# EAGLE design PlugEVSE_Main (EAGLE 8.6.0)
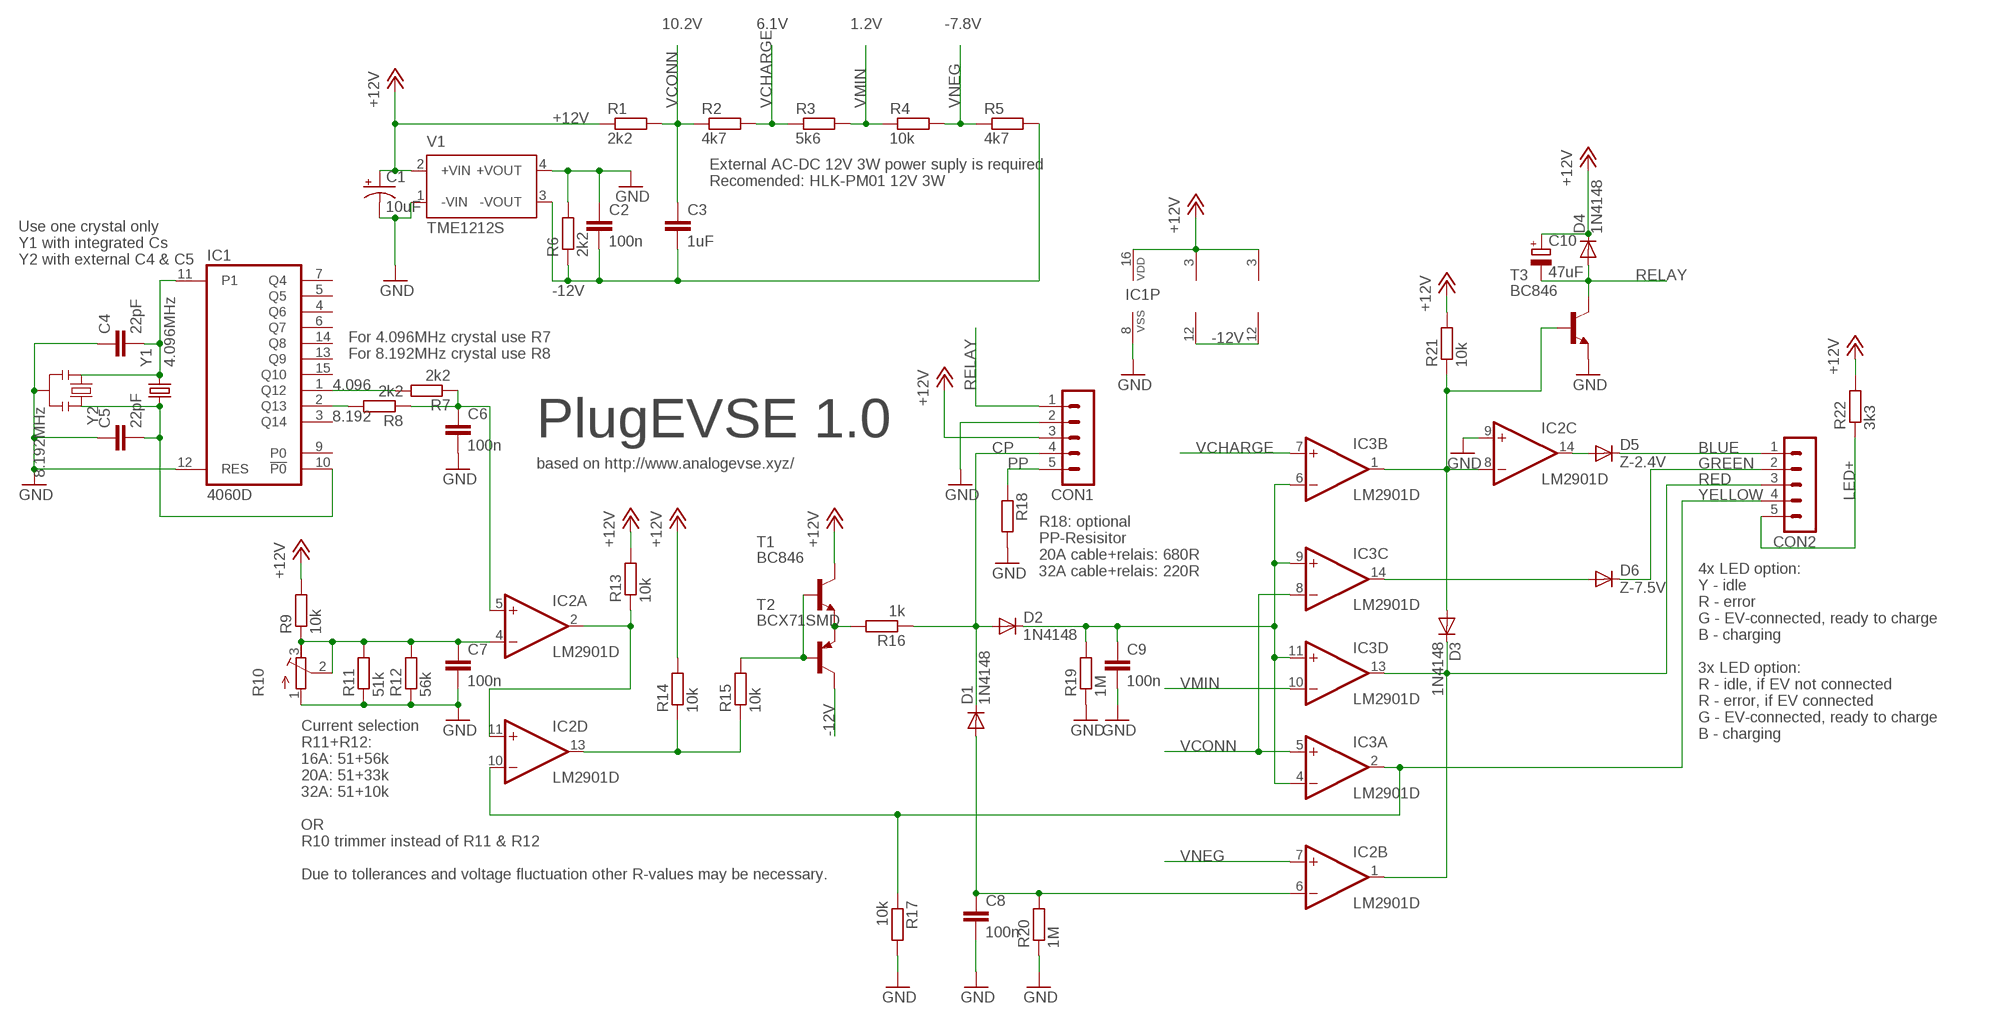
[diagram p0: schematic, sheet 1]

## Parts
C1  10uF  CAP_POL1206  [EIA3216]
C2  100n  C-EUC0603  [C0603]
C3  1uF  C-EUC0603  [C0603]
C4  22pF  C-EUC0603  [C0603]
C5  22pF  C-EUC0603  [C0603]
C6  100n  C-EUC0603  [C0603]
C7  100n  C-EUC0603  [C0603]
C8  100n  C-EUC0603  [C0603]
C9  100n  C-EUC0603  [C0603]
C10  47uF  CPOL-EUE2.5-5  [E2,5-5]
CON1  MA05-1  [MA05-1]
CON2  MA05-1  [MA05-1]
D1  1N4148  DIODE-SOD123  [SOD123]
D2  1N4148  DIODE-SOD123  [SOD123]
D3  1N4148  DIODE-SOD123  [SOD123]
D4  1N4148  DIODE-SOD123  [SOD123]
D5  Z-2.4V  DIODE-SOD123  [SOD123]
D6  Z-7.5V  DIODE-SOD123  [SOD123]
IC1  4060D  [SO16]
IC2  LM2901D  [SO14]
IC3  LM2901D  [SO14]
R1  2k2  R-EU_R0603  [R0603]
R2  4k7  R-EU_R0603  [R0603]
R3  5k6  R-EU_R0603  [R0603]
R4  10k  R-EU_R0603  [R0603]
R5  4k7  R-EU_R0603  [R0603]
R6  2k2  R-EU_R0603  [R0603]
R7  2k2  R-EU_R0603  [R0603]
R8  2k2  R-EU_R0603  [R0603]
R9  10k  R-EU_R0603  [R0603]
R10  R-TRIMM3202  [RTRIM3202]
R11  51k  R-EU_R0603  [R0603]
R12  56k  R-EU_R0603  [R0603]
R13  10k  R-EU_R0603  [R0603]
R14  10k  R-EU_R0603  [R0603]
R15  10k  R-EU_R0603  [R0603]
R16  1k  R-EU_R0603  [R0603]
R17  10k  R-EU_R0603  [R0603]
R18  R-EU_R2512  [R2512]
R19  1M  R-EU_R0603  [R0603]
R20  1M  R-EU_R0603  [R0603]
R21  10k  R-EU_R0603  [R0603]
R22  3k3  R-EU_R0603  [R0603]
T1  BC846  [SOT23]
T2  BCX71SMD  [SOT23]
T3  BC846  [SOT23]
V1  TME1212S  [TME]
Y1  4.096MHz  KX-K  [11.4X4.5]
Y2  8.192MHz  RESONATORSMD  [RESONATOR-SMD]

## Nets
+12V: C1.A(+) C10.+ CON1.3 D4.C IC1.16(VDD) IC2.3(P:V+) IC3.3(P:V+) R1.1 R9.2 R13.2 R14.2 R21.2 R22.2 T1.3(C) V1.2(+VIN)
-12V: C2.2 C3.2 IC2.12(P:V-) IC3.12(P:V-) R5.2 R6.1 T2.3(C) V1.3(-VOUT)
BLUE: CON2.1 D5.C
CP: CON1.4 D1.C D2.A R16.1
GND: C1.C(-) C2.1 C4.1 C5.1 C6.2 C7.2 C8.2 C9.2 CON1.2 IC1.8(VSS) IC1.12(RES) IC2.9(C:+IN) R6.2 R10.1(A) R11.1 R12.1 R17.2 R18.2 R19.1 R20.1 T3.2(E) V1.1(-VIN) V1.4(+VOUT) Y2.2
GREEN: CON2.2 D6.C
LED+: CON2.5 R22.1
N$1: R16.2 T1.2(E) T2.2(E)
N$2: IC1.2(Q13) R8.2
N$3: IC1.1(Q12) R7.2
N$4: C6.1 IC2.5(A:+IN) R7.1 R8.1
N$6: IC2.13(D:OUT) R14.1 R15.1
N$7: C8.1 D1.A IC2.6(B:-IN) R20.2
N$8: C9.1 D2.C IC3.4(A:-IN) IC3.6(B:-IN) IC3.9(C:+IN) IC3.11(D:+IN) R19.2
N$9: D3.A IC2.8(C:-IN) IC3.1(B:OUT) R21.1 T3.1(B)
N$11: C7.1 IC2.4(A:-IN) R9.1 R10.2(S) R10.3(E) R11.2 R12.2
N$12: IC2.2(A:OUT) IC2.11(D:+IN) R13.1
N$13: R15.2 T1.1(B) T2.1(B)
N$15: C4.2 IC1.11(P1) Y1.2 Y2.1
N$16: D5.A IC2.14(C:OUT)
N$18: D6.A IC3.14(C:OUT)
N$21: C5.2 IC1.10(!P0) Y1.1 Y2.3
PP: CON1.5 R18.1
RED: CON2.3 D3.C IC2.1(B:OUT) IC3.13(D:OUT)
RELAY: C10.- CON1.1 D4.A T3.3(C)
VCHARGE: IC3.7(B:+IN) R2.2 R3.1
VCONN: C3.1 IC3.5(A:+IN) IC3.8(C:-IN) R1.2 R2.1
VMIN: IC3.10(D:-IN) R3.2 R4.1
VNEG: IC2.7(B:+IN) R4.2 R5.1
YELLOW: CON2.4 IC2.10(D:-IN) IC3.2(A:OUT) R17.1
Unconnected: IC1.3(Q14) IC1.4(Q6) IC1.5(Q5) IC1.6(Q7) IC1.7(Q4) IC1.9(P0) IC1.13(Q9) IC1.14(Q8) IC1.15(Q10)

## Notes on the sheet
- 10.2V | 6.1V | 1.2V | -7.8V
- External AC-DC 12V 3W power suply is required
  Recomended: HLK-PM01 12V 3W
- Use one crystal only 
  Y1 with integrated Cs
  Y2 with external C4 & C5
- For 4.096MHz crystal use R7
  For 8.192MHz crystal use R8
- 4.096
- 8.192
- PlugEVSE 1.0
- based on http://www.analogevse.xyz/
- R18: optional
  PP-Resisitor
  20A cable+relais: 680R
  32A cable+relais: 220R
- 4x LED option:
  Y - idle
  R - error
  G - EV-connected, ready to charge
  B - charging
  
  3x LED option:
  R - idle, if EV not connected
  R - error, if EV connected
  G - EV-connected, ready to charge
  B - charging
- Current selection
  R11+R12:
  16A: 51+56k
  20A: 51+33k
  32A: 51+10k
  
  OR
  R10 trimmer instead of R11 & R12
  
  Due to tollerances and voltage fluctuation other R-values may be necessary.

## Library data of the parts
C1 = SparkFun:CAP_POL: Capacitor Polarized These are standard SMD and PTH capacitors. Normally 10uF, 47uF, and 100uF in electrolytic and tantalum varieties. Always verify the external diameter of the through hole cap, it varies with capacity, voltage, and manufacturer. The EIA devices should be standard.
C2-C9 = rcl:C-EU: CAPACITOR, European symbol; SPICEPREFIX: C
C10 = rcl:CPOL-EU: POLARIZED CAPACITOR, European symbol; SPICEPREFIX: C
CON1 CON2 = con-lstb:MA05-1: PIN HEADER; OC_FARNELL: unknown; OC_NEWARK: unknown
D1-D6 = diode:DIODE-: DIODE
IC1 = 40xx:4060: 14-stage binary/ripple COUNTER
IC2 IC3 = linear:LM2901: COMPARATOR
R1-R9 R11-R17 R19-R22 = rcl:R-EU_: RESISTOR, European symbol; SPICEPREFIX: R
R10 = resistor:R-TRIMM: Trimm resistor
R18 = rcl:R-EU_: RESISTOR, European symbol
T1 T3 = transistor:BC846: NPN TRANSISTOR
T2 = transistor-pnp:BCX71SMD: PNP Transistor
V1 = traco-electronic:TME?*: DC/DC Converter TME Series 1 Watt Source: www.tracopower.com .. tme.pdf; MPN: TME 1212S; OC_FARNELL: 1007545; OC_NEWARK: 51R5327
Y1 = crystal-geyer_V1_0:KX: Quartz Crystals (MHz) SMD: KX - Serie Model Size l/w/h [mm] Frequency Range Frequency Stability Temp. Range [°C] Load Capacitance AECQ 200 availabel Datasheet KX-4 KX-5 KX-6 KX-7 KX-9A KX-9B KX-12A KX-12B KX-13 KX-20 KX-K KX-KS 1.6/1.2/0.3 2.0/1.6/0.45 2.5/2.0/0.55 3.2/2.5/0.8 5.0/3.2/1.0 5.0/3.2/1.1 6.0/3.5/1.1 6.0/3.5/1.0 7.0/5.0 /1.3 11.6/5.5/1.6 12.3/4.5/4.2 12.3/4.5/3.2 24.0 ~ 80.0 MHz 16.0 ~ 80.0 MHz 12.0 ~ 80.0 MHz 8.0 ~ 60.0 MHz 7,68 ~ 300,0 MHz 8,0 ~ 50,0 MHz 8,0 ~ 150,0 MHz 8,0 ~ 50,0 MHz 6,0 ~ 160,0 MHz 3,579 ~ 25,0 MHz 3,579 ~ 70,0 MHz 3,579 ~ 70,0 MHz ±10 … ±50ppm ±10 … ±50ppm ±10 … ±50ppm ±10 … ±50ppm ±10 … ±50ppm ±10 … ±50ppm ±10 … ±50ppm ±10 … ±50ppm ±10 … ±50ppm ±50ppm ±10 … ±50ppm ±10 … ±50ppm (*) -40°C …+85°C (*) -40°C …+125°C (*) -40°C …+125°C (*) -40°C …+125°C (*) -40°C …+105°C (*) -40°C …+105°C (*) -40°C …+125°C (*) -40°C …+105°C (*) -40°C …+105°C (*) -40°C …+105°C (*) -40°C …+85°C (*) -40°C …+85°C 8, 8…16 8, 8…16 10, 8…16 12, 7…20 16, 10…20 16, 10…20 16, 10…20 16, 12…20 16, 12…20 16, 12…20 16, 12…30 16, 12…30 - yes yes yes - - - - - - - - KX-4.pdf <http://www.geyer-electronic.de/uploads/tx_userartikelfrequenz/GEYER-KX-4.pdf> KX-5.pdf <http://www.geyer-electronic.de/uploads/tx_userartikelfrequenz/GEYER-KX-5.pdf> KX-6.pdf <http://www.geyer-electronic.de/uploads/tx_userartikelfrequenz/GEYER-KX-6.pdf> KX-7.pdf <http://www.geyer-electronic.de/uploads/tx_userartikelfrequenz/GEYER-KX-7.pdf> KX-9A.pdf <http://www.geyer-electronic.de/uploads/tx_userartikelfrequenz/GEYER-KX-9A.pdf> KX-9B.pdf <http://www.geyer-electronic.de/uploads/tx_userartikelfrequenz/GEYER-KX-9B.pdf> KX-12A.pdf <http://www.geyer-electronic.de/uploads/tx_userartikelfrequenz/GEYER-KX-12A.pdf> KX-12B.pdf <http://www.geyer-electronic.de/uploads/tx_userartikelfrequenz/GEYER-KX-12B.pdf> KX-13.pdf <http://www.geyer-electronic.de/uploads/tx_userartikelfrequenz/GEYER-KX-13.pdf> KX-20.pdf <http://www.geyer-electronic.de/uploads/tx_userartikelfrequenz/GEYER-KX-20.pdf> KX-K.pdf <http://www.geyer-electronic.de/uploads/tx_userartikelfrequenz/GEYER-KX-K.pdf> KX-KS.pdf <http://www.geyer-electronic.de/uploads/tx_userartikelfrequenz/GEYER-KX-KS.pdf> <http://www.geyer-electronic.de/fileadmin/template/img/logo-geyer-electronic.png> Details see: http://www.geyer-electronic.de/Frequenz-Produkte.9.0.html Created 2016-06-07, Hans Locher 2016 (C) Geyer Quartz Technology KX4,KX5,KX6,KX7,KX9A,KX9B,KX12A,KX12B,KX13,KX20,KXK,KXKS;1612;2016;2520;3225;5032;6035;7050;11655;12345;1,6x1,2;2,0x1,6;2,5x2,0;3,2x2,5;5,0x3,2;6,0x3,5;7,0x5,0;11,6x5,5;12,3x4,5;12,3x4,5;1.6x1.2;2.0x1.6;2.5x2.0;3.2x2.5;5.0x3.2;6.0x3.5;7.0x5.0;11.6x5.5;12.3x4.5;12.3x4.5;
Y2 = SparkFun:RESONATOR: Resonator Small SMD resonator. This is the itty bitty 10/20MHz resonators with built in caps. CSTCE10M0G55 and CSTCE20M0V53. Footprint has been reviewed closely but hasn't been tested yet.

## Net classes
0 default: width 0.203 mm

## Board
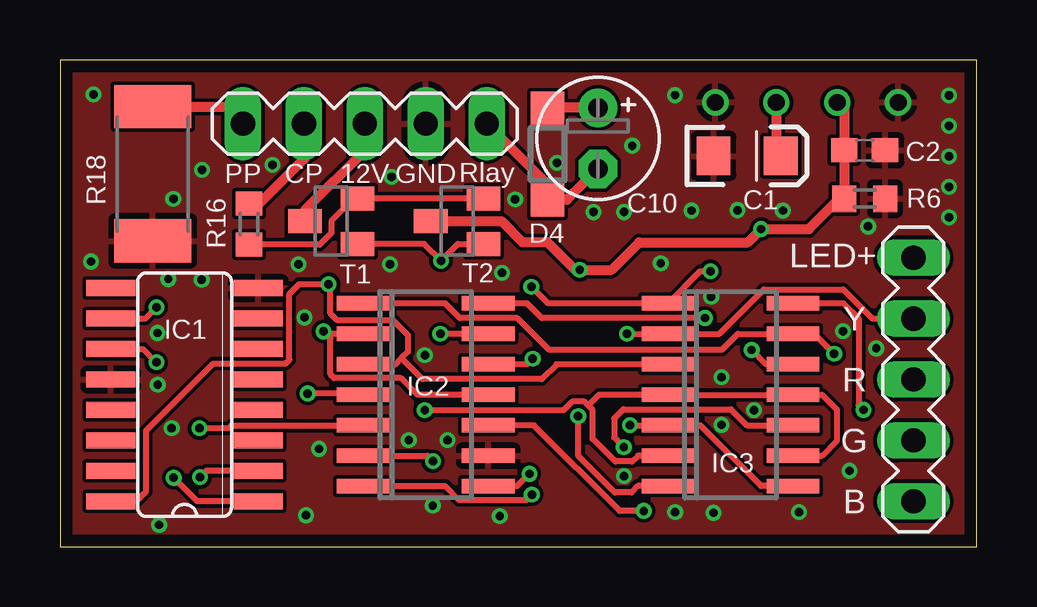
[diagram p1: board, top side]
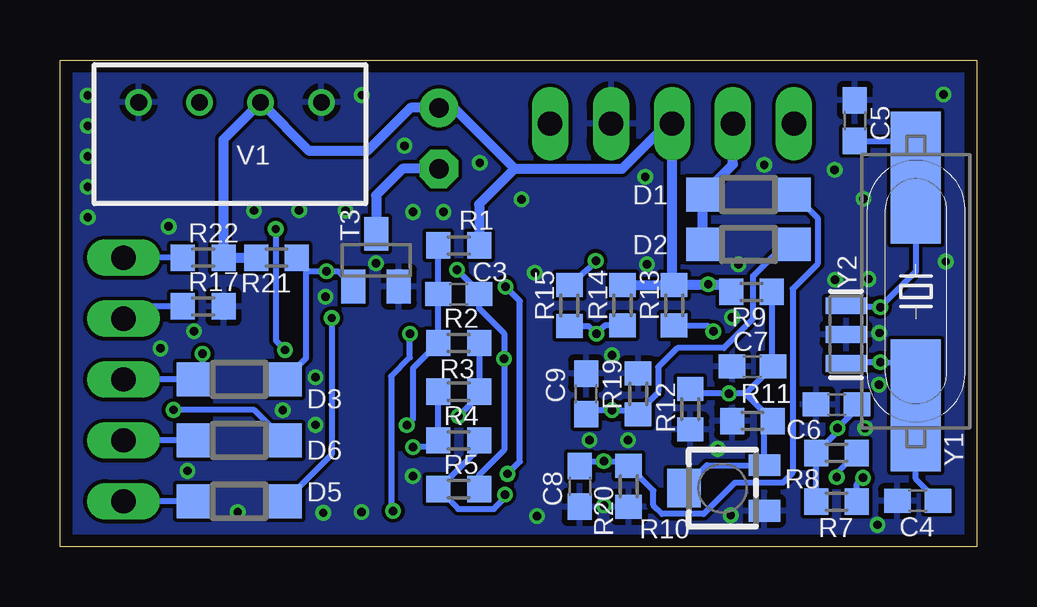
[diagram p2: board, bottom side, seen from below]

Size 38.2 x 20.31 mm. Coordinates in mm from the lower left corner, seen from the top.
Outline: 0,0 38.2,0 38.2,20.31 0,20.31 0,0
Copper layers (1*16): Top 0.035mm / dielectric 1.6mm / Bottom 0.035mm
Design rules "Elecrow_2-layer_PCB_eagle_rule": minimum track width 6mil, minimum drill 12mil, track to track 6mil, track to pad 6mil, pad to pad 6mil, via to via 8mil, smd to smd 0mil, copper to edge 20mil, drill to drill 10mil, minimum pad ring 6mil, minimum via ring 6mil, stop-mask expansion 0mil, vias tented up to drill 100mil, thermal gap 10mil

### Footprints (pad centres in the part's own frame; a part is rotated, then mirrored left to right if it is on the bottom)
EIA3216 = smd 1.4 x 1.6: A 1.4,0; C -1.4,0
C0603 = smd 1.1 x 1: 1 -0.85,0; 2 0.85,0
E2,5-5 = drill 0.813 pad 1.6: + -1.27,0 | drill 0.813 pad 1.6 octagon: - 1.27,0
MA05-1 = drill 1.016 long: 1 -5.08,0; 2 -2.54,0; 3 0,0; 4 2.54,0; 5 5.08,0
SOD123 = smd 1.4 x 1.4: A 1.9,0; C -1.9,0
SO16 = smd 0.66 x 2.032: 1 -4.445,-3.073; 2 -3.175,-3.073; 3 -1.905,-3.073; 4 -0.635,-3.073; 5 0.635,-3.073; 6 1.905,-3.073; 7 3.175,-3.073; 8 4.445,-3.073; 9 4.445,3.073; 10 3.175,3.073; 11 1.905,3.073; 12 0.635,3.073; 13 -0.635,3.073; 14 -1.905,3.073; 15 -3.175,3.073; 16 -4.445,3.073
SO14 = smd 0.6 x 2.2: 1 -3.81,-2.6; 2 -2.54,-2.6; 3 -1.27,-2.6; 4 0,-2.6; 5 1.27,-2.6; 6 2.54,-2.6; 7 3.81,-2.6; 8 3.81,2.6; 9 2.54,2.6; 10 1.27,2.6; 11 0,2.6; 12 -1.27,2.6; 13 -2.54,2.6; 14 -3.81,2.6
R0603 = smd 1 x 1.1: 1 -0.85,0; 2 0.85,0
RTRIM3202 = smd 0.9 x 1.3: 1 -0.95,-1.75; 3 0.95,-1.75 | smd 1.6 x 1.4: 2 0,1.6
R2512 = smd 1.8 x 3.2: 1 -2.8,0; 2 2.8,0
SOT23 = smd 1 x 1.4: 1 -0.95,-1.1; 2 0.95,-1.1; 3 0,1.1
TME = drill 0.7 pad 1.1: 1 -3.81,0; 2 -1.27,0; 3 1.27,0; 4 3.81,0
11.4X4.5 = smd 5.5 x 2.08: 1 -4.75,0; 2 4.75,0
RESONATOR-SMD = smd 0.7 x 1.7: 1 -1.2,0; 2 0,0; 3 1.2,0

### Placement (x,y rotation side)
C1  28.63,16.31 0 top
C2  33.53,16.54 180 top
C3  21.59,10.54 0 bottom
C4  2.46,1.92 0 bottom
C5  5.08,17.78 270 bottom
C6  5.84,5.95 180 bottom
C7  9.35,7.52 180 bottom
C8  16.55,2.53 270 bottom
C9  16.28,6.38 90 bottom
C10  22.41,17.05 270 top
CON1  12.7,17.65 180 top
CON2  35.56,6.99 90 top
D1  9.51,14.7 0 bottom
D2  9.51,12.62 180 bottom
D3  30.73,6.99 0 bottom
D4  20.32,16.38 270 top
D5  30.73,1.91 0 bottom
D6  30.73,4.45 0 bottom
IC1  5.19,6.35 90 top
IC2  15.24,6.35 270 top
IC3  27.94,6.35 270 top
R1  21.59,12.57 180 bottom
R2  21.59,8.51 0 bottom
R3  21.59,6.48 180 bottom
R4  21.59,4.45 0 bottom
R5  21.59,2.41 0 bottom
R6  33.53,14.52 0 top
R7  5.84,1.89 0 bottom
R8  5.84,3.92 0 bottom
R9  9.39,10.64 180 bottom
R10  10.6,2.46 90 bottom
R11  9.35,5.25 0 bottom
R12  11.94,5.75 90 bottom
R13  12.61,10.08 90 bottom
R14  14.76,10.08 90 bottom
R15  16.98,10.07 90 bottom
R16  7.87,13.46 270 top
R17  32.23,10.03 0 bottom
R18  3.87,15.57 270 top
R19  14.11,6.38 270 bottom
R20  14.51,2.53 90 bottom
R21  29.18,12.06 180 bottom
R22  32.23,12.06 0 bottom
T1  11.3,13.59 90 top
T2  16.55,13.59 90 top
T3  25.03,11.96 0 bottom
V1  31.11,18.54 180 bottom
Y1  2.54,10.66 270 bottom
Y2  5.45,8.86 90 bottom

### Tracks (layer width: path | path; a pad name or v marks a point on that pad's centre or on a via)
+12V  (via drill 0.35)
  Top 0.254: IC3.3 20.69,7.62 20.07,7 15.1,7 14.22,7.88 | IC2.3 13.97,7.62 14.22,7.88 | 14.22,7.88 14.5,8.15 14.5,8.82 13.86,9.47 11.54,9.47 11.26,9.74 11.26,10.89 v11.19,10.96 9.96,10.96 9.56,10.56 9.56,7.81 9.4,7.64 6.38,7.64 3.58,4.85 3.58,2.31 3.17,1.91 IC1.16
  Top 0.406: CON1.3 12.7,16.54 10.2,14.04 T1.3 | V1.2 29.84,16.5 C1.A | D4.C 20.39,18.21 20.49,18.32 C10.+
  Bottom 0.406: 19.26,15.77 14.78,15.77 12.9,17.65 CON1.3 12.7,11.02 R13.2 | R14.2 R13.2 | R9.2 10.53,10.93 11.43,10.93 | 11.43,10.93 R13.2 | 11.43,10.93 11.4,10.96 v11.19,10.96 | 19.26,15.77 20.74,14.29 R1.1 | R22.2 31.38,17.01 V1.2 27.81,16.51 25.4,16.51 23.59,18.32 C10.+ 21.8,18.32 19.26,15.77 | R22.2 31.11,12.06 | R22.2 R21.2
-12V  (via drill 0.35)
  Top 0.254: IC3.12 29.42,7.62 v28.82,8.22 | v19.7,7.85 19.46,7.62 IC2.12
  Top 0.406: T2.3 18.4,13.59 19.29,12.7 20.32,12.7 21.46,11.56 v21.66,11.56 22.99,11.56 24.13,12.7 28.65,12.7 v29.21,13.26 31.2,13.26 32.47,14.52 R6.1 C2.2 32.68,18.25 V1.3
  Bottom 0.254: R5.2 20.74,3 19.7,4.04 v19.7,7.85 19.7,8.91 20.74,9.95 C3.2 20.74,10.64 v21.66,11.56 | v28.82,8.22 29.21,8.61 v29.21,13.26
BLUE
  Bottom 0.254: D5.C CON2.1
CP
  Top 0.406: CON1.4 10.16,16.17 8.3,14.31 R16.1
  Bottom 0.406: D2.A D1.C 10.16,15.95 CON1.4
GND  (via drill 0.35)
  other vias: 16.14,4.45 15.2,7.99 8.86,15.94 30.12,14.03 25.63,18.84 22.23,13.97 23.5,13.97 28.23,14.05 27.56,7.08 32.89,3.17 18.32,1.29 10.79,4.09 4.51,11.17 1.39,18.87 1.29,11.9 10.25,1.32 4.13,0.92 27.23,1.42 30.79,1.45 37.04,18.83 37.04,17.56 37.04,16.29 37.04,15.02 37.04,13.75 23.84,16.73 34.01,8.28 18.41,11.43 18.96,14.5 13.81,15.43 13.74,11.79 4.72,14.52 27.56,5.09 25.63,1.45 15.53,1.73 4.65,4.95 4.07,6.77 5.9,11.14 5.92,15.72 33.67,13.37 9.94,11.79 20.71,16.02 14.53,4.45 26.31,14.03 10.19,9.57 4.06,8.92 28.92,5.71 27.13,10.44 25.03,11.84 23.5,2.95 32.62,8.99
  pour Bottom: 0.6,19.7 37.6,19.7 37.6,0.6 0.6,0.6
  pour Top: 0.6,19.7 0.6,0.6 37.6,0.6 37.6,19.7
GREEN
  Bottom 0.254: D6.C CON2.2
LED+
  Bottom 0.254: R22.1 CON2.5
N$1
  Top 0.254: T2.2 T1.2 12.25,14.54 11.3,13.59 11.3,13.09 10.82,12.61 R16.2
N$2  (via drill 0.35)
  Top 0.254: IC1.2 6.1,3.17 v5.84,2.91
  Bottom 0.254: 4.64,3.92 R8.2 5.84,3.07 v5.84,2.91
N$3  (via drill 0.35)
  Top 0.254: IC1.1 5.72,1.91 v4.74,2.89
  Bottom 0.254: R7.2 4.99,2.63 v4.74,2.89
N$4  (via drill 0.35)
  Top 0.254: v5.81,4.95 7.03,4.95 7.13,5.05 12.62,5.05 IC2.5
  Bottom 0.254: R7.1 R8.1 5.81,4.8 v5.81,4.95 4.99,5.77 C6.1 4.99,6.02
N$6  (via drill 0.35)
  Top 0.254: IC2.13 v15.85,8.89
  Bottom 0.254: R14.1 15.51,9.23 v15.85,8.89 16.17,9.22 R15.1
N$7  (via drill 0.35)
  Top 0.254: v15.54,3.58 15.31,3.81 IC2.6
  Bottom 0.254: D1.A 6.63,13.72 6.63,11.8 7.67,10.76 7.67,3.09 8.08,2.68 10.08,2.68 11.38,1.38 13.12,1.38 13.48,1.74 13.48,2.35 R20.2 14.71,3.58 v15.54,3.58 16.35,3.58 C8.1
N$8  (via drill 0.35)
  Top 0.254: 22,5.91 22.2,5.71 22.2,4.5 23.14,3.56 23.84,3.56 24.09,3.81 IC3.6 | 22,5.91 21.84,6.07 21.34,6.07 20.97,5.7 v15.2,5.7 | 22,5.91 22.45,6.35 IC3.4 IC3.11 31.75,6.35 32.38,5.71 32.38,4.45 31.75,3.81 IC3.9
  Bottom 0.254: D2.C 8.01,12.62 9.32,11.31 9.32,9.52 10.54,8.3 12.48,8.3 13.28,7.5 13.28,6.44 14.11,5.61 | 14.11,5.61 R19.2 | 14.11,5.61 14.2,5.7 v15.2,5.7 16.11,5.7 C9.1
N$9  (via drill 0.35)
  Top 0.254: IC2.8 19.05,2.54 v19.56,3.05 | v19.64,10.86 20.34,10.16 IC3.1 26.68,11.5 v27.1,11.5
  Bottom 0.254: v19.56,3.05 19.04,3.57 19.04,10.26 v19.64,10.86 | T3.1 26.61,11.5 v27.1,11.5 27.87,11.5 | 28.21,7.61 D3.A 27.94,7.88 27.94,11.43 27.87,11.5 | 27.87,11.5 28.33,11.96 R21.1
N$11  (via drill 0.35)
  Top 0.254: 12.59,6.3 IC2.4 12.59,6.4 v10.32,6.4
  Bottom 0.254: R9.1 8.54,7.46 C7.1 9.62,6.4 9.65,6.4 | R11.2 8.61,5.36 | 8.61,5.36 9.65,6.4 | 9.65,6.4 v10.32,6.4 11.74,6.4 R12.2 | R10.2 11.25,3.41 R10.3 8.85,5.12 8.61,5.36
N$12  (via drill 0.35)
  Top 0.254: IC2.11 14.89,6.35 14.2,7.04 11.42,7.04 11.26,7.2 11.26,8.71 v10.98,8.99 11.08,8.89 IC2.2
  Bottom 0.254: R13.1 11.22,9.23 v10.98,8.99
N$13  (via drill 0.35)
  Top 0.254: T1.1 15.17,12.64 v15.88,11.94 16.58,12.64 T2.1
  Bottom 0.254: R15.2 15.84,11.9 v15.88,11.94
N$15  (via drill 0.35)
  Top 0.254: IC1.11 3.46,8.26 v4.02,7.7
  Bottom 0.254: 2.54,6.32 Y1.2 | C4.2 2.54,2.85 Y1.2 | Y2.1 5.41,7.7 v4.02,7.7 2.62,7.7 2.54,7.62 Y1.2
N$16  (via drill 0.35)
  Top 0.254: IC2.14 19.46,10.16 20.07,9.55 v26.88,9.55
  Bottom 0.254: 28.57,1.91 D5.A 26.88,3.86 v26.88,9.55
N$18  (via drill 0.35)
  Top 0.254: IC3.14 32.64,10.16 33.27,9.53 33.27,5.92 v33.47,5.71
  Bottom 0.254: D6.A 30.1,5.71 v33.47,5.71
N$21  (via drill 0.35)
  Top 0.254: IC1.10 3.54,9.53 v4.02,10
  Bottom 0.254: Y2.3 5.39,10 v4.02,10 2.54,11.48 2.54,15.24 Y1.1 2.54,16.51 2.96,16.93 C5.2
PP
  Top 0.406: R18.1 6.91,18.37 CON1.5
RED  (via drill 0.35)
  Top 0.254: IC2.1 16.05,10.16 16.66,9.55 19.05,9.55 20.36,8.23 27.59,8.23 28.25,8.89 IC3.13 31.42,8.89 v32.26,8.05
  Bottom 0.254: CON2.3 D3.C 32.26,7.37 v32.26,8.05
RELAY
  Top 0.406: CON1.1 20.32,15.11 D4.A 21.12,14.48 C10.-
  Bottom 0.406: T3.3 25.03,14.67 23.93,15.78 C10.-
VCHARGE  (via drill 0.35)
  Top 0.254: v21.59,5.46 21.59,3.81 23.12,2.28 23.81,2.28 24.08,2.54 IC3.7
  Bottom 0.254: R2.2 R3.1 20.74,6.31 v21.59,5.46
VCONN  (via drill 0.35)
  Top 0.254: v23.75,5.08 IC3.5 26.67,5.08 29.21,2.54 IC3.8
  Bottom 0.254: R1.2 C3.1 R2.1 23.5,7.45 23.5,5.33 v23.75,5.08
VMIN  (via drill 0.35)
  Top 0.254: IC3.10 28.61,5.08 27.95,5.74 23.48,5.74 23.09,5.35 23.09,4.57 v23.49,4.17
  Bottom 0.254: R3.2 R4.1 22.44,4.61 22.88,4.17 v23.49,4.17
VNEG  (via drill 0.35)
  Top 0.254: IC2.7 16.05,2.54 16.62,1.96 19.05,1.96 19.06,1.96 19.43,1.96 v19.66,2.19
  Bottom 0.254: R4.2 20.74,4.11 R5.1 21.61,1.58 20.12,1.58 19.66,2.05 v19.66,2.19
YELLOW  (via drill 0.35)
  Top 0.254: v23.62,8.89 IC3.2 27.48,8.89 29.32,10.74 32.63,10.74 33.85,9.53 CON2.4 | IC2.10 19.75,5.08 23.32,1.5 v24.32,1.5
  Bottom 0.254: R17.1 35.05,10.03 CON2.4 | v23.62,8.89 23.62,7.9 24.41,7.12 24.41,1.59 v24.32,1.5

### Text on the board
tNames: PP | CP | 12V | GND | Rlay | LED+ | Y | R | G | B